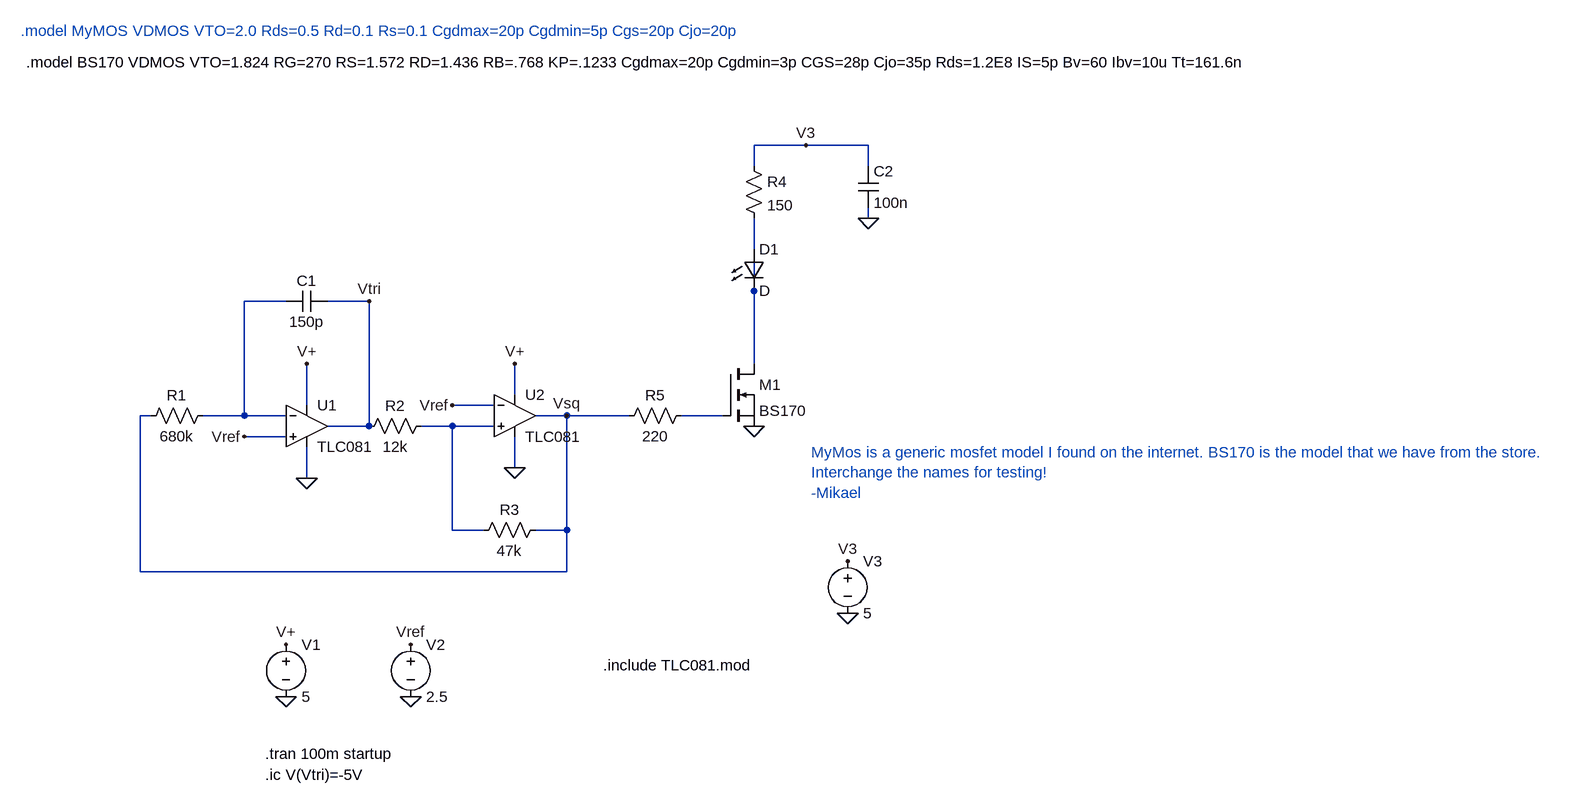
[diagram p0: schematic Transmitter with mosfet model added.asc]
Transmitter with mosfet model added.asc, the LTspice schematic file:
Version 4
SHEET 1 5412 728
WIRE 784 -352 704 -352
WIRE 880 -352 784 -352
WIRE 704 -320 704 -352
WIRE 880 -320 880 -352
WIRE 880 -240 880 -256
WIRE 704 -192 704 -240
WIRE 704 -128 704 -176
WIRE -16 -112 -80 -112
WIRE 112 -112 48 -112
WIRE 704 -16 704 -128
WIRE 336 32 336 -16
WIRE 16 48 16 -16
WIRE 304 48 240 48
WIRE -224 64 -240 64
WIRE -80 64 -80 -112
WIRE -80 64 -144 64
WIRE -16 64 -80 64
WIRE 416 64 368 64
WIRE 512 64 416 64
WIRE 656 64 592 64
WIRE 112 80 112 -112
WIRE 112 80 48 80
WIRE 240 80 192 80
WIRE 304 80 240 80
WIRE -16 96 -80 96
WIRE 336 144 336 96
WIRE 16 160 16 112
WIRE 240 240 240 80
WIRE 288 240 240 240
WIRE 416 240 416 64
WIRE 416 240 368 240
WIRE -240 304 -240 64
WIRE 416 304 416 240
WIRE 416 304 -240 304
FLAG 16 -16 V+
FLAG 336 -16 V+
FLAG 416 64 Vsq
FLAG -16 496 0
FLAG -16 416 V+
FLAG 112 -112 Vtri
FLAG 16 160 0
FLAG 336 144 0
FLAG 176 496 0
FLAG 176 416 Vref
FLAG -80 96 Vref
FLAG 240 48 Vref
FLAG 880 -240 0
FLAG 848 368 0
FLAG 704 80 0
FLAG 784 -352 V3
FLAG 848 288 V3
SYMBOL res -128 48 R90
WINDOW 0 0 56 VBottom 2
WINDOW 3 32 56 VTop 2
SYMATTR InstName R1
SYMATTR Value 680k
SYMBOL cap -16 -96 R270
WINDOW 0 32 32 VTop 2
WINDOW 3 0 32 VBottom 2
SYMATTR InstName C1
SYMATTR Value 150p
SYMBOL res 208 64 R90
WINDOW 0 0 56 VBottom 2
WINDOW 3 32 56 VTop 2
SYMATTR InstName R2
SYMATTR Value 12k
SYMBOL res 384 224 R90
WINDOW 0 0 56 VBottom 2
WINDOW 3 32 56 VTop 2
SYMATTR InstName R3
SYMATTR Value 47k
SYMBOL voltage -16 400 R0
SYMATTR InstName V1
SYMATTR Value 5
SYMBOL voltage 176 400 R0
WINDOW 123 0 0 Left 0
WINDOW 39 0 0 Left 0
SYMATTR InstName V2
SYMATTR Value 2.5
SYMBOL opamp2 16 16 R0
SYMATTR InstName U1
SYMATTR Value TLC081
SYMBOL opamp2 336 0 R0
SYMATTR InstName U2
SYMATTR Value TLC081
SYMBOL LED 688 -192 R0
SYMATTR InstName D1
SYMBOL Res 688 -336 R0
SYMATTR InstName R4
SYMATTR Value 150
SYMBOL Cap 864 -320 R0
SYMATTR InstName C2
SYMATTR Value 100n
SYMBOL Res 608 48 R90
WINDOW 0 0 56 VBottom 2
WINDOW 3 32 56 VTop 2
SYMATTR InstName R5
SYMATTR Value 220
SYMBOL voltage 848 272 R0
SYMATTR InstName V3
SYMATTR Value 5
SYMBOL nmos 656 -16 R0
SYMATTR InstName M1
SYMATTR Value BS170
TEXT -48 584 Left 2 !.tran 100m startup
TEXT -48 616 Left 2 !.ic V(Vtri)=-5V
TEXT 472 448 Left 2 !.include TLC081.mod
TEXT -416 -480 Left 2 !.model BS170 VDMOS VTO=1.824 RG=270 RS=1.572 RD=1.436 RB=.768 KP=.1233 Cgdmax=20p Cgdmin=3p CGS=28p Cjo=35p Rds=1.2E8 IS=5p Bv=60 Ibv=10u Tt=161.6n
TEXT -424 -528 Left 2 ;.model MyMOS VDMOS VTO=2.0 Rds=0.5 Rd=0.1 Rs=0.1 Cgdmax=20p Cgdmin=5p Cgs=20p Cjo=20p
TEXT 792 120 Left 2 ;MyMos is a generic mosfet model I found on the internet. BS170 is the model that we have from the store. \nInterchange the names for testing!\n-Mikael

The netlist it stands for:
* Transmitter with mosfet model added.asc
R1 N003 Vsq 680k
C1 N003 Vtri 150p
R2 N005 Vtri 12k
R3 Vsq N005 47k
V1 V+ 0 5
V2 Vref 0 2.5
XU1 Vref N003 V+ 0 Vtri TLC081  ; pins In+ In- V+ V- OUT
XU2 N005 Vref V+ 0 Vsq TLC081  ; pins In+ In- V+ V- OUT
D1 N001 N002 D
R4 V3 N001 150
C2 V3 0 100n
R5 N004 Vsq 220
V3 V3 0 5
M1 N002 N004 0 0 BS170
.model D D
.lib standard.dio
.model NMOS NMOS
.model PMOS PMOS
.lib standard.mos
.tran 100m startup
.ic V(Vtri)=-5V
.include TLC081.mod
.model BS170 VDMOS VTO=1.824 RG=270 RS=1.572 RD=1.436 RB=.768 KP=.1233 Cgdmax=20p Cgdmin=3p CGS=28p Cjo=35p Rds=1.2E8 IS=5p Bv=60 Ibv=10u Tt=161.6n
* .model MyMOS VDMOS VTO=2.0 Rds=0.5 Rd=0.1 Rs=0.1 Cgdmax=20p Cgdmin=5p Cgs=20p Cjo=20p
* MyMos is a generic mosfet model I found on the internet. BS170 is the model that we have from the store.
* Interchange the names for testing!
* -Mikael
.backanno
.end